# EAGLE design iv-17single (EAGLE 7.2.0)
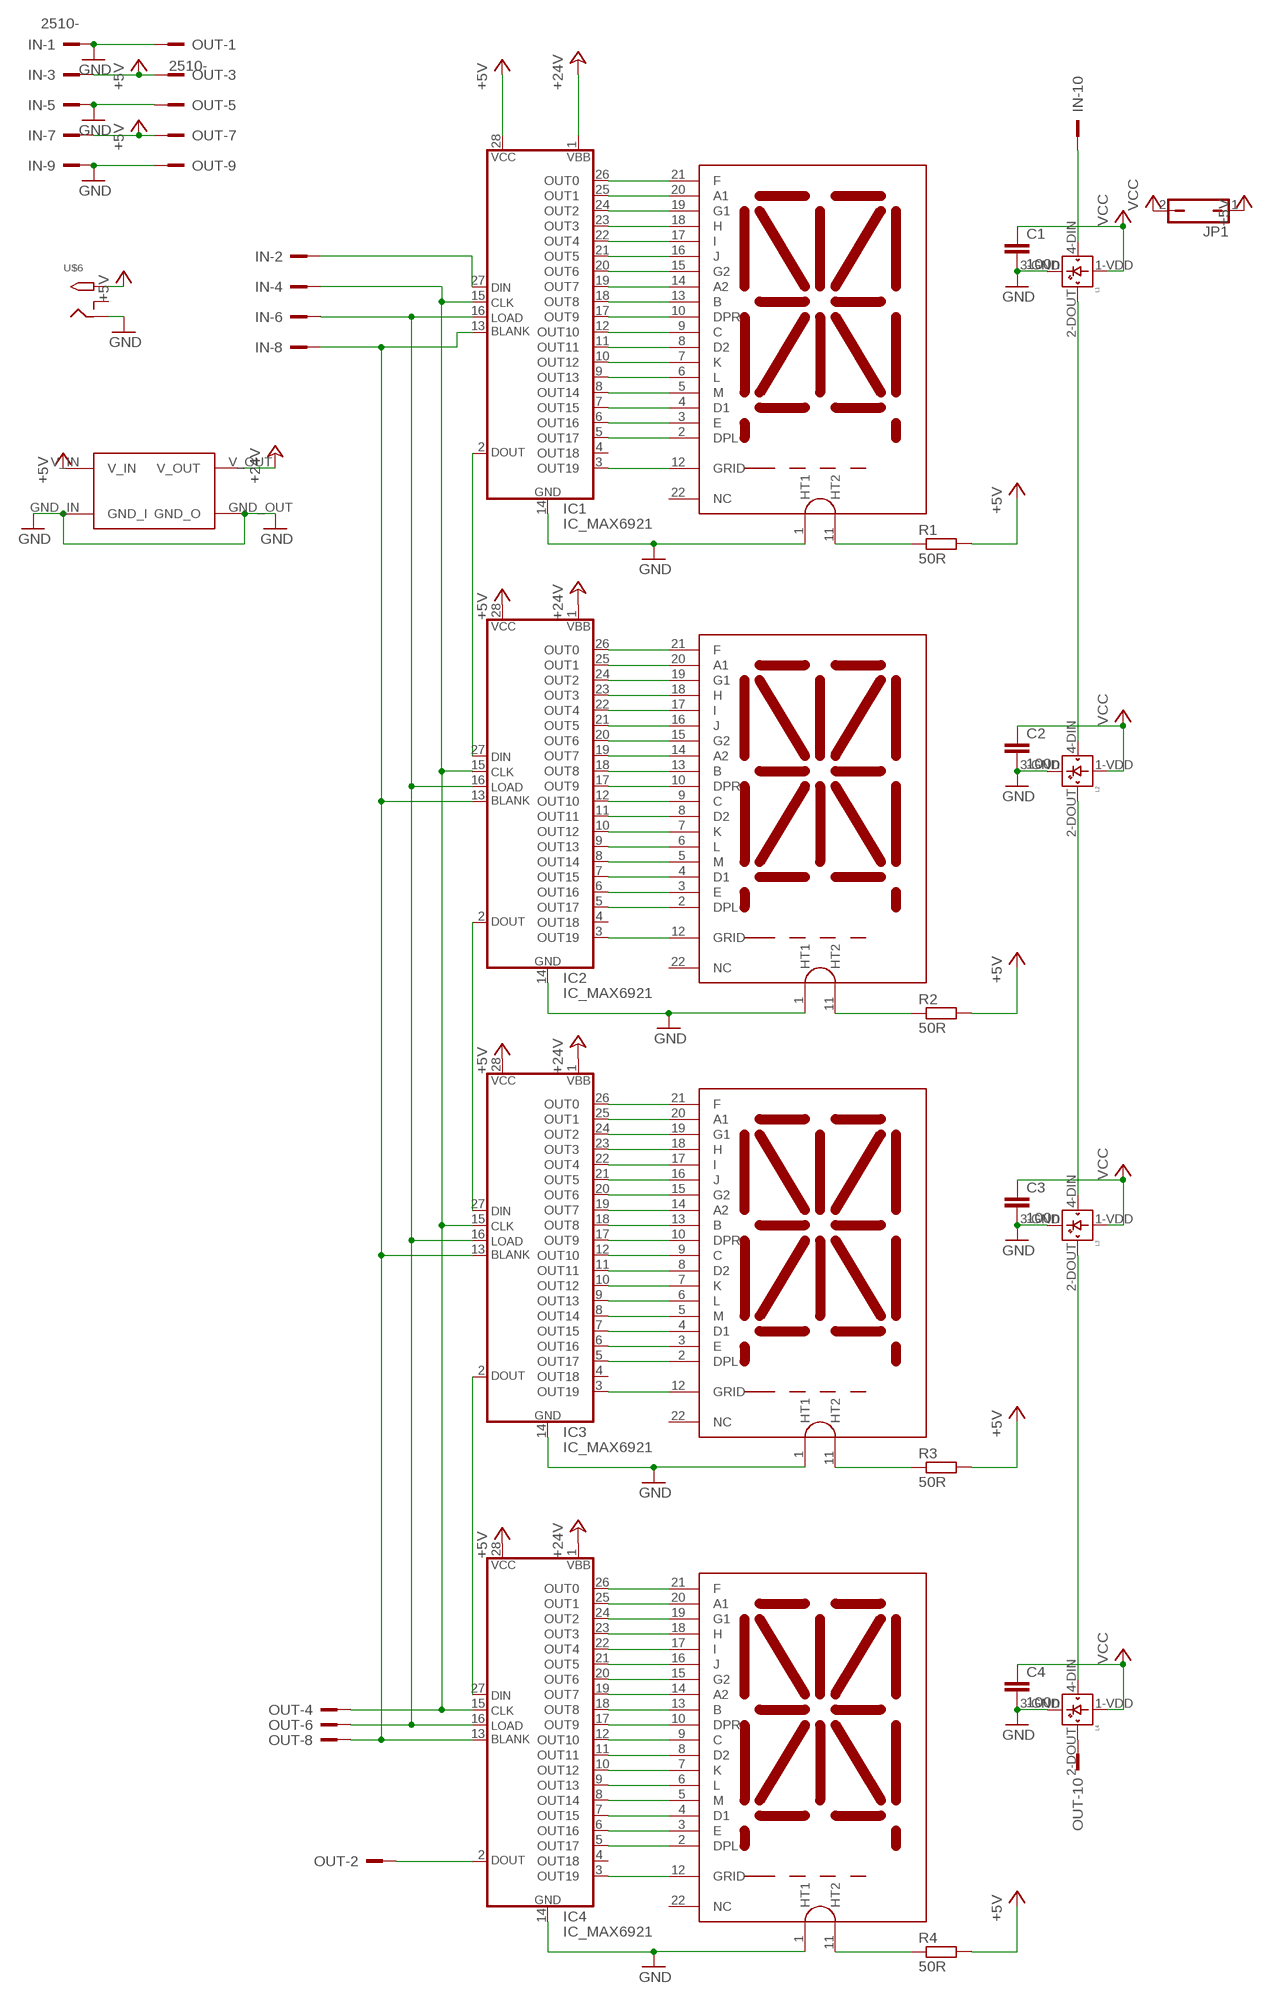
[diagram p0: schematic, sheet 1]

## Parts
1  IV-17_DISPIV-17  [IV-17]
2  IV-17_DISPIV-17  [IV-17]
3  IV-17_DISPIV-17  [IV-17]
4  IV-17_DISPIV-17  [IV-17]
C1  100n  C-EUC0805  [C0805]
C2  100n  C-EUC0805  [C0805]
C3  100n  C-EUC0805  [C0805]
C4  100n  C-EUC0805  [C0805]
IC1  IC_MAX6921  [S28]
IC2  IC_MAX6921  [S28]
IC3  IC_MAX6921  [S28]
IC4  IC_MAX6921  [S28]
IN  2510-  [PAK100/2500-10]
JP1  JP1Q  [JP1]
L1  WS2812B  [WS2812B]
L2  WS2812B  [WS2812B]
L3  WS2812B  [WS2812B]
L4  WS2812B  [WS2812B]
OUT  2510-  [PAK100/2500-10]
R1  50R  R-EU_0207/10  [0207/10]
R2  50R  R-EU_0207/10  [0207/10]
R3  50R  R-EU_0207/10  [0207/10]
R4  50R  R-EU_0207/10  [0207/10]
U$5  STEP_UP_MODULE  [STEP_UP_MODULE]
U$6  2.1MMJACKTHM  [PJ-102A]

## Nets
+5V [power]: IC1.28(VCC) IC2.28(VCC) IC3.28(VCC) IC4.28(VCC) IN.3 IN.7 JP1.1 OUT.3 OUT.7 R1.2 R2.2 R3.2 R4.2 U$5.V_IN U$6.TIP
+24V [lo_power]: IC1.1(VBB) IC2.1(VBB) IC3.1(VBB) IC4.1(VBB) U$5.V_OUT
GND [power]: 1.1(HT1) 2.1(HT1) 3.1(HT1) 4.1(HT1) C1.2 C2.2 C3.2 C4.2 IC1.14(GND) IC2.14(GND) IC3.14(GND) IC4.14(GND) IN.1 IN.5 IN.9 L1.3-GND(GND) L2.3-GND(GND) L3.3-GND(GND) L4.3-GND(GND) OUT.1 OUT.5 OUT.9 U$5.GND_IN(GND_I) U$5.GND_OUT(GND_O) U$6.RING
N$1 [lo_power]: 1.11(HT2) R1.1
N$2: 1.21(F) IC1.26(OUT0)
N$3: 1.20(A1) IC1.25(OUT1)
N$4: 1.19(G1) IC1.24(OUT2)
N$5: 1.18(H) IC1.23(OUT3)
N$6: 1.17(I) IC1.22(OUT4)
N$7: 1.16(J) IC1.21(OUT5)
N$8: 1.15(G2) IC1.20(OUT6)
N$9: 1.14(A2) IC1.19(OUT7)
N$10: 1.13(B) IC1.18(OUT8)
N$11: 1.10(DPR) IC1.17(OUT9)
N$12: 1.9(C) IC1.12(OUT10)
N$13: 1.8(D2) IC1.11(OUT11)
N$14: 1.7(K) IC1.10(OUT12)
N$15: 1.6(L) IC1.9(OUT13)
N$16: 1.5(M) IC1.8(OUT14)
N$17: 1.4(D1) IC1.7(OUT15)
N$18: 1.3(E) IC1.6(OUT16)
N$19: 1.2(DPL) IC1.5(OUT17)
N$20: 1.12(GRID) IC1.3(OUT19)
N$21: IC1.27(DIN) IN.2
N$22: IC4.2(DOUT) OUT.2
N$23: 2.21(F) IC2.26(OUT0)
N$24: L1.2-DOUT(DOUT) L2.4-DIN(DIN)
N$25: IC1.2(DOUT) IC2.27(DIN)
N$26: 2.20(A1) IC2.25(OUT1)
N$27: 2.19(G1) IC2.24(OUT2)
N$28: 2.18(H) IC2.23(OUT3)
N$29: 2.17(I) IC2.22(OUT4)
N$30: 2.16(J) IC2.21(OUT5)
N$31: 2.15(G2) IC2.20(OUT6)
N$32: 2.14(A2) IC2.19(OUT7)
N$33: 2.13(B) IC2.18(OUT8)
N$34: 2.10(DPR) IC2.17(OUT9)
N$35: 2.9(C) IC2.12(OUT10)
N$36: IC1.15(CLK) IC2.15(CLK) IC3.15(CLK) IC4.15(CLK) IN.4 OUT.4
N$37: 2.8(D2) IC2.11(OUT11)
N$38: 2.7(K) IC2.10(OUT12)
N$39: 2.6(L) IC2.9(OUT13)
N$40: 2.5(M) IC2.8(OUT14)
N$41: 2.4(D1) IC2.7(OUT15)
N$42: 2.3(E) IC2.6(OUT16)
N$43: 2.2(DPL) IC2.5(OUT17)
N$44: 2.12(GRID) IC2.3(OUT19)
N$45: IC1.16(LOAD) IC2.16(LOAD) IC3.16(LOAD) IC4.16(LOAD) IN.6 OUT.6
N$46 [lo_power]: 2.11(HT2) R2.1
N$47: 3.21(F) IC3.26(OUT0)
N$48: 3.20(A1) IC3.25(OUT1)
N$49: 3.19(G1) IC3.24(OUT2)
N$50: 3.18(H) IC3.23(OUT3)
N$51: 3.17(I) IC3.22(OUT4)
N$52: 3.16(J) IC3.21(OUT5)
N$53: 3.15(G2) IC3.20(OUT6)
N$54: 3.14(A2) IC3.19(OUT7)
N$55: 3.13(B) IC3.18(OUT8)
N$56: 3.10(DPR) IC3.17(OUT9)
N$57: 3.9(C) IC3.12(OUT10)
N$58: 3.8(D2) IC3.11(OUT11)
N$59: 3.7(K) IC3.10(OUT12)
N$60: 3.6(L) IC3.9(OUT13)
N$61: 3.5(M) IC3.8(OUT14)
N$62: 3.4(D1) IC3.7(OUT15)
N$63: 3.3(E) IC3.6(OUT16)
N$64: 3.2(DPL) IC3.5(OUT17)
N$65: 3.12(GRID) IC3.3(OUT19)
N$66 [power]: IC1.13(BLANK) IC2.13(BLANK) IC3.13(BLANK) IC4.13(BLANK) IN.8 OUT.8
N$67 [lo_power]: 3.11(HT2) R3.1
N$68: 4.21(F) IC4.26(OUT0)
N$69: 4.20(A1) IC4.25(OUT1)
N$70: 4.19(G1) IC4.24(OUT2)
N$71: 4.18(H) IC4.23(OUT3)
N$72: 4.17(I) IC4.22(OUT4)
N$73: 4.16(J) IC4.21(OUT5)
N$74: 4.15(G2) IC4.20(OUT6)
N$75: 4.14(A2) IC4.19(OUT7)
N$76: 4.13(B) IC4.18(OUT8)
N$77: 4.10(DPR) IC4.17(OUT9)
N$78: 4.9(C) IC4.12(OUT10)
N$79: 4.8(D2) IC4.11(OUT11)
N$80: 4.7(K) IC4.10(OUT12)
N$81: 4.6(L) IC4.9(OUT13)
N$82: 4.5(M) IC4.8(OUT14)
N$83: 4.4(D1) IC4.7(OUT15)
N$84: 4.3(E) IC4.6(OUT16)
N$85: 4.2(DPL) IC4.5(OUT17)
N$86: 4.12(GRID) IC4.3(OUT19)
N$87: L2.2-DOUT(DOUT) L3.4-DIN(DIN)
N$88 [lo_power]: 4.11(HT2) R4.1
N$89: L3.2-DOUT(DOUT) L4.4-DIN(DIN)
N$90: IN.10 L1.4-DIN(DIN)
N$91: L4.2-DOUT(DOUT) OUT.10
N$131: IC2.2(DOUT) IC3.27(DIN)
N$132: IC3.2(DOUT) IC4.27(DIN)
VCC [lo_power]: C1.1 C2.1 C3.1 C4.1 JP1.2 L1.1-VDD(VDD) L2.1-VDD(VDD) L3.1-VDD(VDD) L4.1-VDD(VDD)
Unconnected: 1.22(NC) 2.22(NC) 3.22(NC) 4.22(NC) IC1.4(OUT18) IC2.4(OUT18) IC3.4(OUT18) IC4.4(OUT18) U$6.RING_SW

## Library data of the parts
1-4 = vfd:IV-17_DISP
C1-C4 = resistor:C-EU: CAPACITOR, European symbol
IC1-IC4 = rob:IC_MAX6921: 20-outputs, 76V, serial VFD driver Dangerousprototypes.com
IN OUT = con-3m:2510-: 3M (TM) Pak 100 4-Wall Header Source: 3M; MF: 3M; MPN: 2510-6002UB; OC_FARNELL: 9838244; OC_NEWARK: 46F4725
JP1 = jumper:JP1Q: JUMPER
L1-L4 = adafruit:WS2812B
R1-R4 = resistor:R-EU_: RESISTOR, European symbol
U$5 = vfd:STEP_UP_MODULE
U$6 = adafruit:2.1MMJACK: 2.1mm x 5.5mm THM DC jack with internal switch. Digikey part #PJ-102A, 4UCON part #05537 2.1mm x 5.5mm SMT DC jack with internal switch. Digikey part #PJ-002A-SMT, 4UCON part #03267 By microbuilder.eu & adafruit.com

## Net classes
1 lo_power: width 0.5 mm
2 power: width 1 mm

## Board
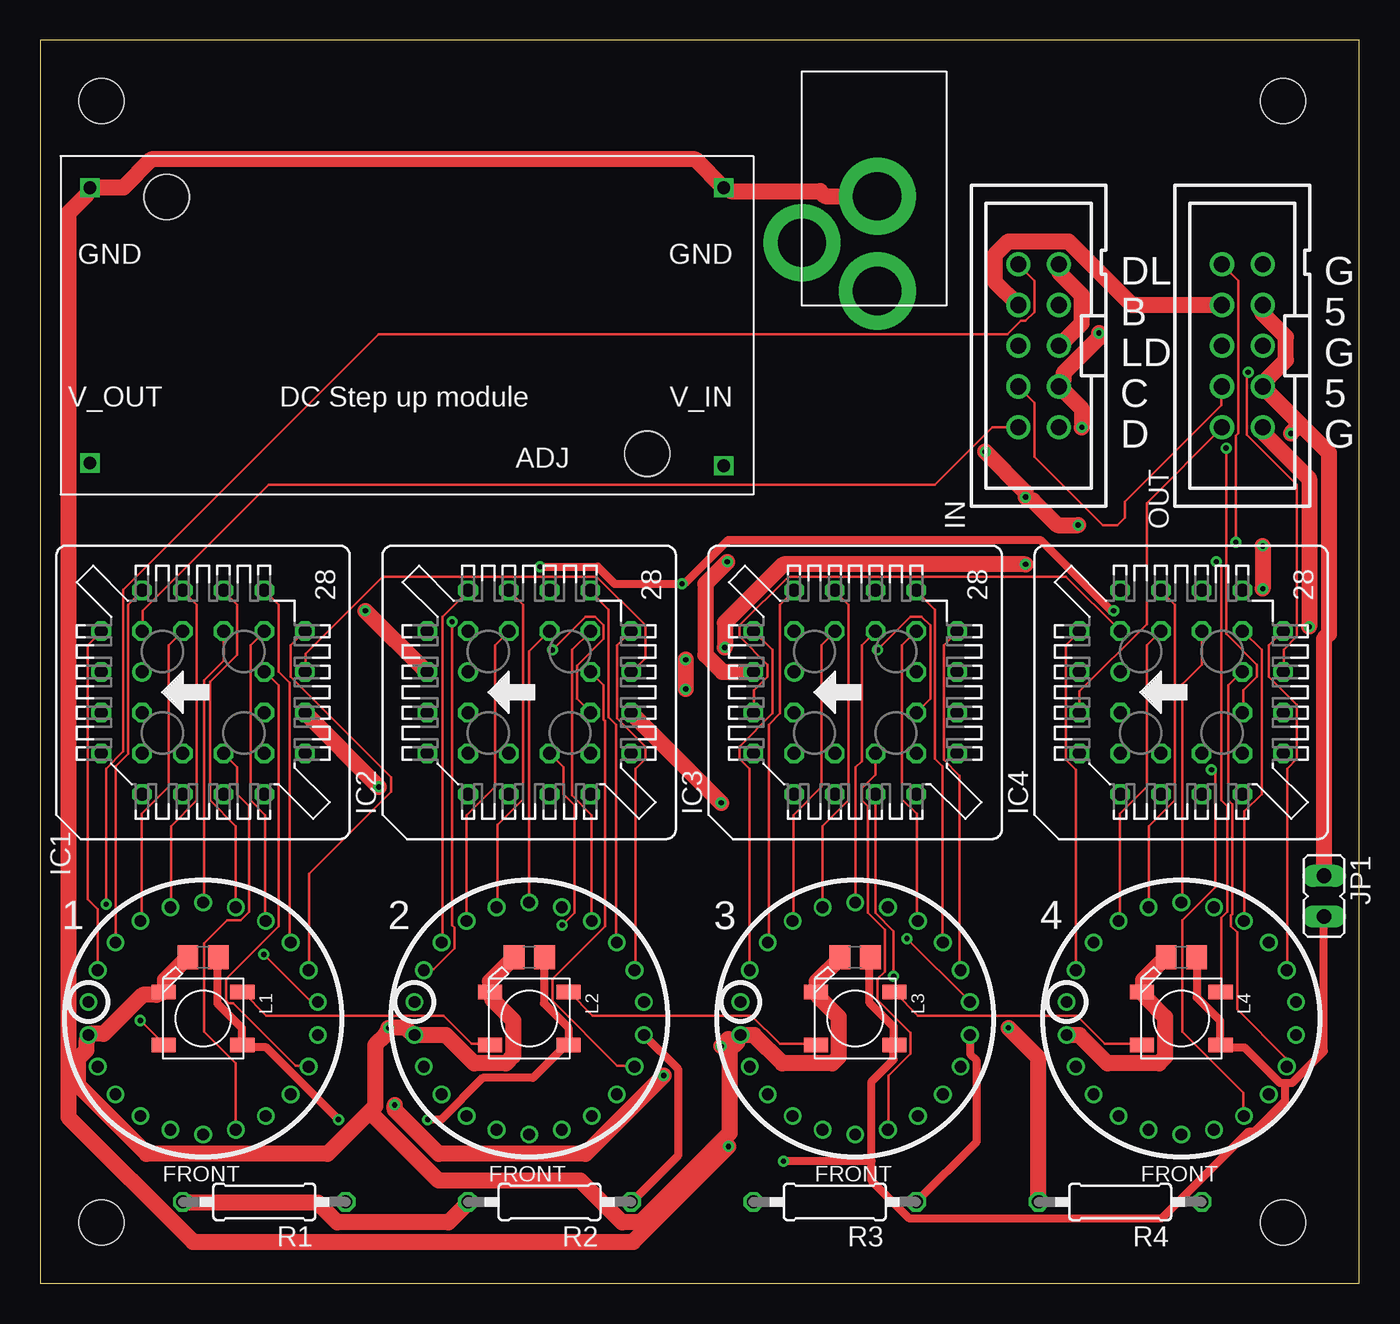
[diagram p1: board, top side]
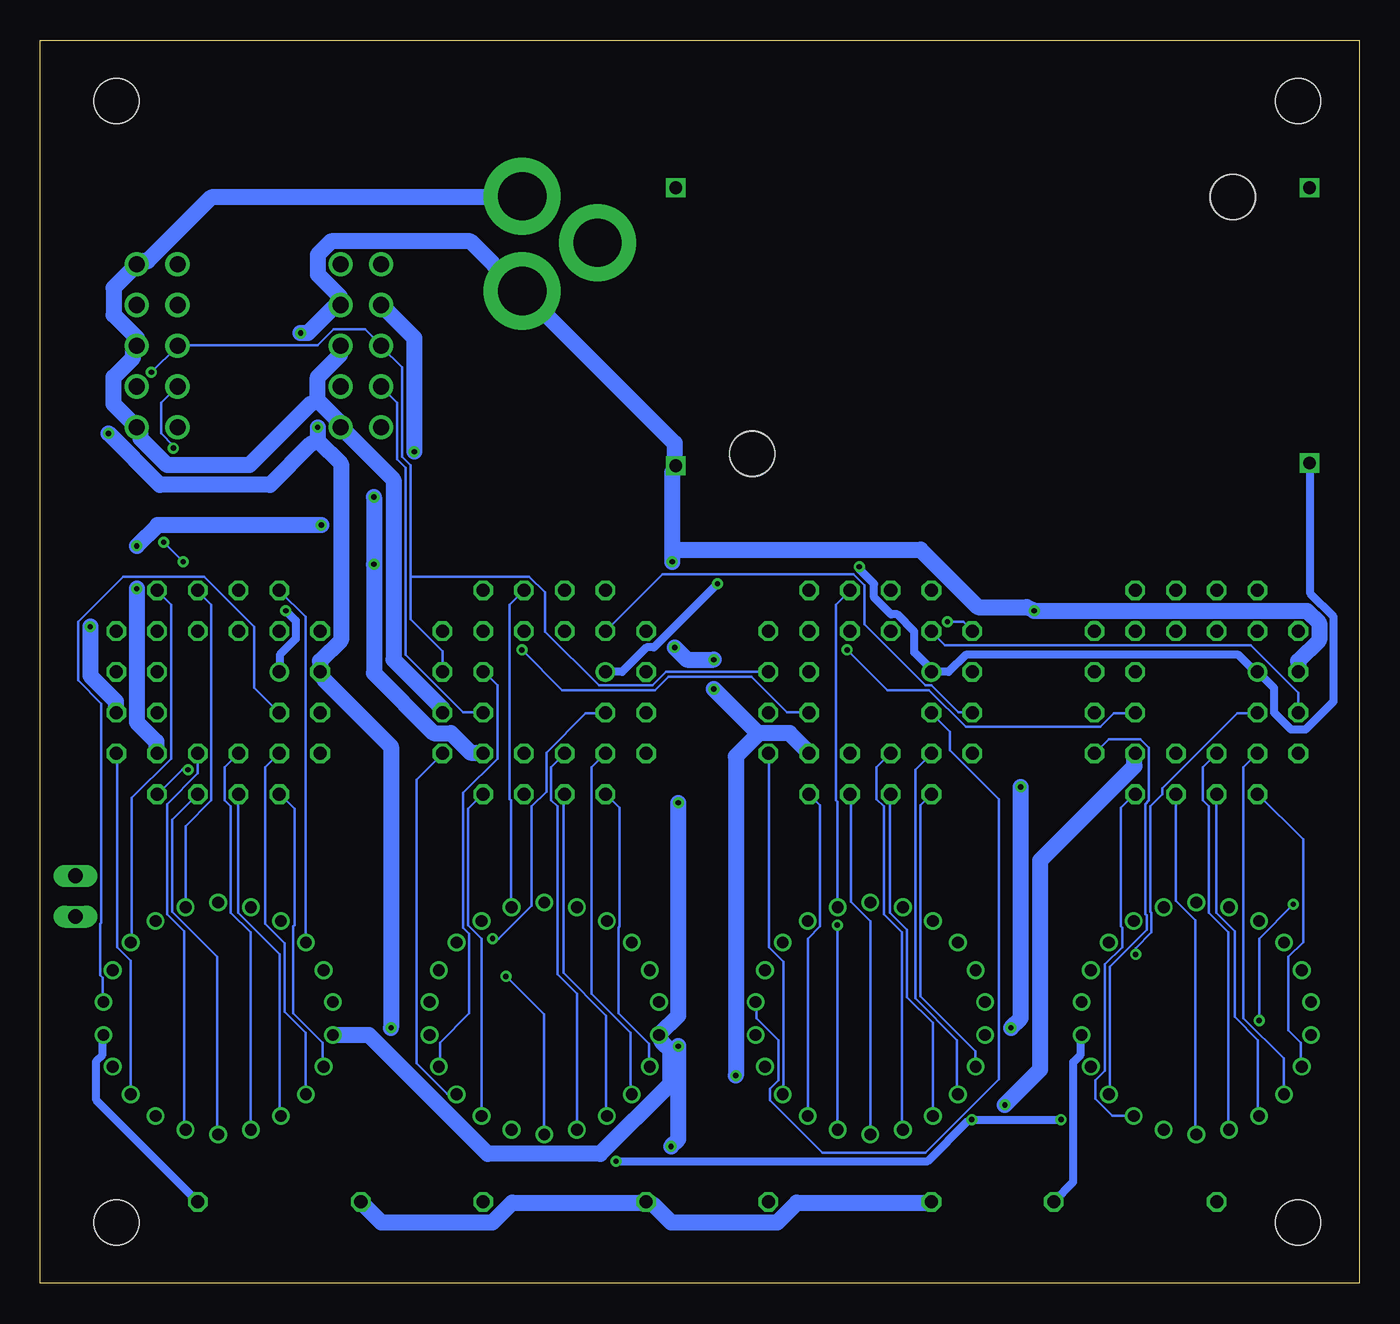
[diagram p2: board, bottom side, seen from below]

Size 82.22 x 77.46 mm. Coordinates in mm from the lower left corner, seen from the top.
Outline: 0,0 82.22,0 82.22,77.46 0,77.46 0,0
Copper layers (1*16): Top 0.0356mm / dielectric 1.5011mm / Bottom 0.0356mm
Design rules "oshpark-2layer": minimum track width 6mil, minimum drill 13mil, track to track 6mil, track to pad 6mil, pad to pad 6mil, via to via 6mil, smd to smd 6mil, copper to edge 15mil, drill to drill 6mil, minimum pad ring 7mil, minimum via ring 7mil, stop-mask expansion 4mil, vias tented up to drill 0mil, thermal gap 10mil
Holes 2.8 mm at 3.81,3.81 3.81,73.66 7.9,67.7 77.47,73.66 77.47,3.81 37.85,51.7

### Footprints (pad centres in the part's own frame; a part is rotated, then mirrored left to right if it is on the bottom)
IV-17 = drill 0.735: 1 -7.15,-1.028; 2 -6.571,-3.001; 3 -5.459,-4.73; 4 -3.905,-6.077; 5 -2.035,-6.931; 6 0,-7.223; 7 2.035,-6.931; 8 3.905,-6.077; 9 5.459,-4.73; 10 6.571,-3.001; 11 7.15,-1.028; 12 7.15,1.028; 13 6.571,3.001; 14 5.459,4.73; 15 3.905,6.077; 16 2.035,6.931; 17 0,7.223; 18 -2.035,6.931; 19 -3.905,6.077; 20 -5.459,4.73; 21 -6.571,3.001; 22 -7.15,1.028
C0805 = smd 1.3 x 1.5: 1 -0.95,0; 2 0.95,0
S28 = drill 0.813: 1 1.27,3.81 | drill 0.813 octagon: 2 -1.27,6.35; 3 -1.27,3.81; 4 -3.81,6.35; 5 -6.35,3.81; 6 -3.81,3.81; 7 -6.35,1.27; 8 -3.81,1.27; 9 -6.35,-1.27; 10 -3.81,-1.27; 11 -6.35,-3.81; 12 -3.81,-6.35; 13 -3.81,-3.81; 14 -1.27,-6.35; 15 -1.27,-3.81; 16 1.27,-6.35; 17 1.27,-3.81; 18 3.81,-6.35; 19 6.35,-3.81; 20 3.81,-3.81; 21 6.35,-1.27; 22 3.81,-1.27; 23 6.35,1.27; 24 3.81,1.27; 25 6.35,3.81; 26 3.81,6.35; 27 3.81,3.81; 28 1.27,6.35
PAK100/2500-10 = drill 1 pad 1.422: 1 -5.08,-1.27; 2 -5.08,1.27; 3 -2.54,-1.27; 4 -2.54,1.27; 5 0,-1.27; 6 0,1.27; 7 2.54,-1.27; 8 2.54,1.27; 9 5.08,-1.27; 10 5.08,1.27
JP1 = drill 0.914 long: 1 0,-1.27; 2 0,1.27
WS2812B = smd 1.5 x 0.9: 1-VDD 2.45,-1.65; 2-DOUT 2.45,1.65; 3-GND -2.45,1.65; 4-DIN -2.45,-1.65
0207/10 = drill 0.813 octagon: 1 -5.08,0; 2 5.08,0
STEP_UP_MODULE = drill 0.8 square: GND_IN -19.749,-8.573; GND_OUT 19.749,-8.573; V_IN -19.749,8.753; V_OUT 19.749,8.573 | hole 2.8: -14.986,8.001; 14.986,-8.001
PJ-102A = drill 3 pad 4.8: RING 0.1,-3.39; RING_SW -4.6,-6.29; TIP 0.1,-9.29

### Placement (x,y rotation side)
1  10.16,16.51 0 top
2  30.48,16.51 0 top
3  50.8,16.51 0 top
4  71.12,16.51 0 top
C1  10.16,20.32 180 top
C2  30.48,20.32 180 top
C3  50.8,20.32 180 top
C4  71.12,20.32 180 top
IC1  10.16,36.83 90 top
IC2  30.48,36.83 90 top
IC3  50.8,36.83 90 top
IC4  71.12,36.83 90 top
IN  62.23,58.42 90 top
JP1  80.01,24.13 180 top
L1  10.16,16.51 0 top
L2  30.48,16.51 0 top
L3  50.8,16.51 0 top
L4  71.12,16.51 0 top
OUT  74.93,58.42 90 top
R1  13.97,5.08 180 top
R2  31.75,5.08 180 top
R3  49.53,5.08 180 top
R4  67.31,5.08 180 top
U$5  22.86,59.69 180 top
U$6  52.07,71.12 0 top

### Tracks (layer width: path | path; a pad name or v marks a point on that pad's centre or on a via)
+5V  (via drill 0.33)
  Top 1: R1.2 8.91,5.03 17.3,5.03 18.52,3.81 25.45,3.81 26.67,5.03 R2.2 | JP1.1 80.01,40.16 80.31,40.46 80.31,51.74 78.52,53.53 | 78.52,53.53 76.2,55.85 OUT.3 76.43,56.31 77.65,57.53 77.65,58.98 76.2,60.43 OUT.7 | v20.27,41.91 24.08,38.1 IC2.28 | v64.92,53.34 64.92,54.48 63.55,55.85 IN.3 63.78,56.31 63.78,56.69 65.99,58.9 v65.99,59.21 | IC3.28 42.52,38.1 41.45,39.17 41.45,43.59 v42.82,44.96 | v77.95,52.96 78.52,53.53 | v60.35,15.93 62.18,14.1 62.18,5.11 R4.2
  Bottom 1: R4.2 60.96,3.81 54.03,3.81 52.81,5.03 44.5,5.03 R3.2 43.97,4.88 42.9,3.81 36.27,3.81 35.05,5.03 26.67,5.03 R2.2 | IC1.28 3.81,38.79 2.52,40.08 2.52,41.15 3.28,41.91 v20.27,41.91 20.73,42.14 23.77,42.14 27.36,45.72 42.82,45.72 | 64.92,52.5 63.48,51.05 63.48,40.08 64.77,38.79 IC4.28 64.54,37.64 60.35,33.45 v60.35,15.93 | v64.92,53.34 64.92,52.5 | 42.82,45.72 42.82,50.52 U$5.V_IN 42.67,50.98 42.67,52.35 52.12,61.8 U$6.TIP 52.58,62.1 55.4,64.92 64.08,64.92 64.92,64.08 64.92,62.87 63.55,61.49 63.55,60.96 IN.7 64.01,60.73 65.53,59.21 v65.99,59.21 | 42.82,45.72 v42.82,44.96 | v77.95,52.96 74.75,49.76 67.89,49.76 65.38,52.27 64.92,52.5
+24V  (via drill 0.33)
  Top 0.5: v31.17,44.65 34.75,44.65 35.81,43.59 v40.01,43.59 40.23,43.66 42.9,46.33 62.33,46.33 66.75,41.91 v66.9,41.91
  Bottom 0.5: U$5.V_OUT 3.05,51.05 3.05,42.98 1.6,41.53 1.6,36.27 3.35,34.52 4.27,34.52 5.33,35.59 5.33,37.11 6.33,38.1 IC1.1 6.55,38.18 7.54,39.17 24.54,39.17 25.6,38.1 IC2.1 26.75,38.33 27.74,39.32 27.74,40.62 28.8,41.68 29.18,41.68 30.25,42.75 30.25,43.59 31.17,44.5 v31.17,44.65 | IC3.1 45.95,38.1 44.42,39.62 43.97,39.62 v40.01,43.59 | v66.9,41.91 66.29,41.3 66.29,40.16 67.28,39.17 67.28,38.1 IC4.1
GND  (via drill 0.33)
  Top 1: C1.2 9.14,20.27 7.77,18.9 7.77,18.21 L1.3-GND 7.24,17.98 6.4,17.98 3.96,15.54 3.05,15.54 1.1 2.9,15.01 2.9,14.55 2.36,14.02 2.36,12.34 6.63,8.08 17.91,8.08 20.54,10.71 | C2.2 29.49,20.27 28.04,18.82 28.04,18.21 L2.3-GND 28.19,17.68 29.49,16.38 29.49,14.17 29.03,13.72 27.05,13.72 25.3,15.47 23.39,15.47 2.1 22.94,15.77 22.78,15.93 v21.72,15.93 21.49,15.47 20.88,14.86 20.88,11.05 20.54,10.71 | v21.11,30.94 16.54,35.51 IC1.14 | C4.2 70.1,20.27 68.73,18.9 68.73,18.21 L4.3-GND 68.96,17.75 70.1,16.61 70.1,14.1 69.72,13.72 66.52,13.72 64.77,15.47 64.01,15.47 4.1 | C3.2 49.84,20.27 48.39,18.82 48.39,18.21 L3.3-GND 48.62,17.75 49.76,16.61 49.76,14.1 49.38,13.72 46.25,13.72 44.5,15.47 43.66,15.47 3.1 43.43,15.01 43.28,14.86 | v42.44,29.95 IC2.14 | 20.54,10.71 24.84,6.4 33.68,6.4 36.27,3.81 37.41,3.81 42.98,9.37 42.98,14.55 43.28,14.86 | v79.1,40.92 79.1,50.14 76.2,53.03 OUT.1 | IN.9 63.55,63.48 63.55,62.94 64.92,61.57 64.92,59.82 63.55,58.45 IN.5 | U$6.RING 52.12,67.74 48.92,67.74 48.62,68.05 43.05,68.05 U$5.GND_IN 42.6,68.28 40.84,70.03 6.93,70.03 5.18,68.28 3.12,68.28 U$5.GND_OUT 2.9,67.82 1.75,66.67 1.75,10.36 9.53,2.59 36.96,2.59 v42.9,8.53 | v42.44,14.78 42.9,15.24 43.28,14.86
  Bottom 1: v21.11,30.94 21.11,16.54 v21.72,15.93 | v42.44,29.95 42.44,16.69 43.59,15.54 3.1 43.43,15.01 42.98,14.55 42.98,12.42 47.32,8.08 54.33,8.08 61.72,15.47 63.93,15.47 4.1 | v79.1,40.92 79.1,37.87 77.5,36.27 77.5,35.59 IC4.14 | IC3.14 57.15,35.81 60.2,38.86 60.2,50.06 63.48,53.34 IN.1 63.7,53.8 64.92,55.02 | 64.92,55.02 64.92,56.46 63.55,57.84 63.55,58.37 IN.5 | 64.92,55.02 65.38,54.79 69.19,50.98 74.3,50.98 75.97,52.65 75.97,52.88 OUT.1 77.65,54.79 77.65,56.46 76.43,57.68 76.43,57.99 OUT.5 76.2,58.9 77.65,60.35 77.65,62.03 76.2,63.48 OUT.9 75.74,63.7 75.51,63.7 71.55,67.67 52.2,67.67 U$6.RING | v42.44,14.78 42.44,8.99 v42.9,8.53
N$1
  Bottom 0.5: 1.11 17.37,15.47 17.37,14.25 17.83,13.79 17.83,6.33 19.05,5.11 R1.1
N$2
  Top 0.152: 1.21 3.58,19.58 3.58,23.32 2.97,23.93 2.97,39.78 3.81,40.62 IC1.26
N$3
  Top 0.152: 1.20 4.72,21.26 4.72,32.23 5.49,32.99 5.49,42.29 6.33,43.13 IC1.25
N$4
  Top 0.152: 1.19 6.33,22.63 6.33,29.26 8,30.94 8,39.78 8.84,40.62 IC1.24
N$5
  Top 0.152: 1.18 8.15,23.47 8.15,28.5 9.75,30.1 9.75,42.29 8.91,43.13 IC1.23
N$6
  Top 0.152: IC1.22 11.43,38.79 10.21,37.57 10.21,23.77 1.17
N$7
  Top 0.152: 1.16 12.19,23.47 12.19,28.5 10.59,30.1 10.59,37.49 12.27,39.17 12.27,42.29 11.43,43.13 IC1.21
N$8
  Top 0.152: IC1.20 13.11,39.78 13.11,30.1 14.02,29.18 14.02,22.63 1.15
N$9
  Top 0.152: IC1.19 14.86,42.29 14.86,38.1 15.54,37.41 15.54,21.26 1.14
N$10
  Top 0.152: 1.13 16.76,19.58 16.76,25.53 21.87,30.63 21.87,31.55 15.62,37.8 15.62,39.78 16.46,40.62 IC1.18
N$11
  Top 0.152: 1.10 16.69,13.56 15.93,13.56 12.04,17.45 11.73,17.45 11.58,17.6 11.58,18.97 14.86,22.25 14.86,37.26 14.02,38.1 IC1.17
N$12
  Bottom 0.152: IC1.12 15.62,33.91 13.64,33.91 13.11,33.38 13.11,30.1 13.34,29.87 13.34,23.01 13.26,22.94 13.26,22.02 15.54,19.74 15.54,11.81 1.9
N$13
  Bottom 0.152: 1.8 14.1,10.44 15.39,10.44 16.46,11.51 16.46,12.65 15.85,13.26 15.85,19.89 14.78,20.95 14.78,22.17 14.86,22.25 14.86,29.64 14.02,30.48 IC1.11
N$14
  Top 0.152: 1.7 12.19,9.6 12.19,13.72 10.21,15.7 10.21,21.18 11.66,22.63 12.5,22.63 13.03,23.16 13.03,29.72 12.27,30.48 12.27,32.16 11.43,32.99 IC1.10
N$15
  Bottom 0.152: IC1.9 11.43,23.85 10.21,22.63 10.21,9.3 1.6
N$16
  Bottom 0.152: IC1.8 9.75,32.16 9.75,30.1 9.37,29.72 9.37,23.09 8.15,21.87 8.15,9.6 1.5
N$17
  Bottom 0.152: 1.4 6.33,10.44 6.33,15.16 7.77,16.61 7.77,21.95 8.91,23.09 8.91,30.48 IC1.7
N$18
  Bottom 0.152: 1.3 4.72,11.81 4.72,14.02 7.24,16.54 7.24,32.16 6.4,32.99 IC1.6
N$19
  Bottom 0.152: 1.2 3.66,13.56 3.66,15.01 4.42,15.77 4.42,20.34 3.5,21.26 3.5,27.66 6.33,30.48 IC1.5
N$20  (via drill 0.33)
  Top 0.152: v13.95,20.5 16.84,17.6 17.3,17.6 1.12
  Bottom 0.152: v13.95,20.5 13.95,20.88 12.95,21.87 12.95,23.09 13.03,23.16 13.03,29.72 12.27,30.48 12.27,30.86 7.62,35.51 6.4,35.51 IC1.3
N$21
  Top 0.152: IN.2 59.36,53.34 55.78,49.76 14.25,49.76 6.4,41.91 6.4,40.69 IC1.27
N$22
  Top 0.152: IC4.2 64.77,36.88 68.96,41.07 68.96,48.62 73.69,53.34 OUT.2
N$23  (via drill 0.33)
  Top 0.152: v25.68,41.22 25.68,22.33 25.83,22.17 25.83,20.88 24.54,19.58 23.93,19.58 2.21
  Bottom 0.152: v25.68,41.22 24.69,41.22 24.16,40.69 IC2.26
N$24
  Top 0.152: L2.4-DIN 27.96,14.94 26.9,14.94 25.15,16.69 14.1,16.69 12.65,18.14 L1.2-DOUT
N$25
  Bottom 0.152: IC1.2 3.81,36.8 6.78,39.78 25.83,39.78 26.67,40.62 IC2.27
N$26
  Top 0.152: 2.20 25.07,21.26 25.07,41.53 26.67,43.13 IC2.25
N$27
  Top 0.152: IC2.24 28.35,39.78 28.35,30.94 26.59,29.18 26.59,22.63 2.19
N$28
  Top 0.152: IC2.23 30.1,42.29 30.1,30.18 28.5,28.57 28.5,23.47 2.18
N$29
  Top 0.152: 2.17 30.48,39.4 31.7,40.62 IC2.22
N$30
  Bottom 0.152: 2.16 32.54,23.47 32.54,30.02 32.61,30.1 32.61,42.29 31.77,43.13 IC2.21
N$31
  Top 0.152: 2.15 34.37,22.63 34.37,29.18 33.15,30.4 33.15,39.47 34.29,40.62 IC2.20
N$32
  Top 0.152: 2.14 35.89,21.26 35.89,34.82 35.43,35.28 35.43,41.99 34.29,43.13 IC2.19
N$33
  Top 0.152: IC2.18 35.97,39.78 35.97,35.2 37.72,33.45 37.72,32.69 37.11,32.08 37.11,19.58 2.13
N$34
  Top 0.152: IC2.17 35.13,37.26 35.13,35.13 35.2,35.05 35.2,22.25 31.93,18.97 31.93,17.6 35.97,13.56 37.03,13.56 2.10
N$35
  Bottom 0.152: 2.9 35.89,11.81 35.89,20.04 36.8,20.95 36.8,32.99 IC2.12
N$36  (via drill 0.33)
  Top 0.152: v31.93,39.47 33.98,41.53 34.59,41.53 35.13,41 35.13,40.16 33.45,38.48 33.45,36.42 34.29,35.59 IC2.15 | v73.91,52.05 73.91,40.46 75.82,38.56 75.82,37.8 74.98,36.96 74.98,35.59 IC4.15 | OUT.4 73.61,55.85 73.61,54.71 67.59,48.69 67.59,47.7 67.13,47.24 66.22,47.24 61.95,51.51 61.95,54.86 60.96,55.85 IN.4 | v52.2,39.47 54.25,41.53 54.94,41.53 55.47,41 55.47,36.42 IC3.15
  Bottom 0.152: v31.93,39.47 29.41,36.96 26.82,36.96 24.54,34.67 16.15,34.67 15.32,35.51 14.02,35.51 IC1.15 | v73.91,52.05 73.91,52.2 74.68,52.96 74.68,54.86 OUT.4 | IC3.15 54.63,35.59 55.85,35.59 59.44,39.17 59.44,50.83 59.97,51.36 59.97,54.86 60.96,55.85 IN.4 | v52.2,39.47 49.68,36.96 43.89,36.96 43.05,37.8 37.87,37.8 35.66,35.59 34.29,35.59 IC2.15
N$37
  Bottom 0.152: IC2.11 33.6,29.79 33.6,22.25 34.37,21.49 34.37,10.44 2.8
N$38  (via drill 0.33)
  Top 0.152: v32.54,22.33 33.3,23.09 33.3,29.79 32.61,30.48 32.61,32.16 IC2.10
  Bottom 0.152: v32.54,22.33 32.54,9.6 2.7
N$39
  Bottom 0.152: 2.6 30.48,22.55 31.7,23.77 31.7,30.48 IC2.9
N$40
  Bottom 0.152: 2.5 28.5,9.6 28.5,21.87 29.64,23.01 29.64,29.72 30.1,30.18 30.1,32.16 29.26,32.99 IC2.8
N$41
  Bottom 0.152: 2.4 26.59,10.44 26.59,16.23 28.19,17.83 28.19,22.02 29.26,23.09 29.26,30.48 IC2.7
N$42
  Bottom 0.152: 2.3 25.07,11.81 25.07,15.16 27.66,17.75 27.66,32 26.67,32.99 IC2.6
N$43
  Bottom 0.152: IC2.5 27.36,29.79 27.36,17.91 23.93,14.48 23.93,13.56 2.2
N$44
  Bottom 0.152: 2.12 37.57,17.53 37.57,16.54 36.2,15.16 36.2,12.65 36.73,12.12 36.73,11.43 33.45,8.15 27.05,8.15 22.48,12.72 22.48,30.18 25.53,33.22 25.53,34.37 26.67,35.51 IC2.3
N$45  (via drill 0.33)
  Top 0.152: v75.29,56.77 75.21,56.69 75.21,52.88 78.33,49.76 78.33,40.31 77.5,39.47 77.5,38.1 IC4.16 | IC1.16 16.54,38.1 16.54,39.24 21.34,44.04 34.67,44.04 37.72,41 37.72,38.94 36.88,38.1 IC2.16
  Bottom 0.152: v75.29,56.77 73.69,58.37 OUT.6 73.61,58.45 64.92,58.45 63.93,59.44 61.95,59.44 60.96,58.45 IN.6 60.96,58.37 59.66,57.07 59.66,51.51 59.13,50.98 59.13,44.04 | IC3.16 57.15,39.4 59.13,41.38 59.13,44.04 | IC2.16 43.2,38.1 44.04,37.26 47.4,37.26 50.75,40.62 50.75,43.05 51.74,44.04 59.13,44.04
N$46
  Top 0.5: 2.11 37.64,15.47 39.78,13.34 39.78,8 36.88,5.11 R2.1
N$47
  Top 0.152: 3.21 44.2,19.58 44.2,32.08 43.59,32.69 43.59,33.45 45.64,35.51 45.64,39.47 44.5,40.62 IC3.26
N$48
  Top 0.152: IC3.25 46.1,42.29 46.1,35.51 45.41,34.82 45.41,21.26 3.20
N$49
  Top 0.152: 3.19 46.94,22.63 46.94,29.18 48.69,30.94 48.69,39.78 49.53,40.62 IC3.24
N$50
  Top 0.152: 3.18 48.77,23.47 48.77,28.5 50.37,30.1 50.37,42.29 49.53,43.13 IC3.23
N$51
  Top 0.152: IC3.22 51.21,39.78 51.21,32.54 50.83,32.16 50.83,23.77 3.17
N$52
  Bottom 0.152: IC3.21 52.96,42.29 52.96,30.18 52.88,30.1 52.88,23.47 3.16
N$53
  Top 0.152: 3.15 54.63,22.63 54.63,29.26 53.72,30.18 53.72,39.78 54.56,40.62 IC3.20
N$54
  Top 0.152: 3.14 56.24,21.26 56.24,32.23 55.78,32.69 55.78,41.99 54.63,43.13 IC3.19
N$55
  Top 0.152: 3.13 57.3,19.58 57.3,31.62 56.31,32.61 56.31,39.78 57.15,40.62 IC3.18
N$56
  Bottom 0.152: 3.10 57.3,13.56 57.3,15.01 55.47,16.84 55.47,21.79 55.85,22.17 55.85,30.56 53.72,32.69 53.72,37.26 54.56,38.1 IC3.17
N$57
  Bottom 0.152: 3.9 56.31,11.81 56.84,11.81 58.75,13.72 58.75,31.39 57.15,32.99 IC3.12
N$58
  Bottom 0.152: 3.8 54.71,21.49 55.55,22.33 55.55,29.57 54.63,30.48 IC3.11
N$59
  Top 0.152: 3.7 52.88,9.6 52.88,12.95 54.25,14.33 54.25,15.62 52.2,17.68 52.2,18.97 52.65,19.43 52.65,22.02 51.59,23.09 51.59,29.72 51.21,30.1 51.21,30.86 52.05,31.7 52.05,32.99 IC3.10
N$60  (via drill 0.33)
  Top 0.152: v53.19,19.13 53.19,21.95 52.05,23.09 52.05,30.48 IC3.9
  Bottom 0.152: v53.19,19.13 50.83,16.76 50.83,9.3 3.6
N$61
  Bottom 0.152: 3.5 48.77,9.6 48.77,18.06 49.99,19.28 49.99,29.72 50.37,30.1 50.37,32.16 49.53,32.99 IC3.8
N$62
  Bottom 0.152: IC3.7 49.61,30.4 49.61,19.36 46.94,16.69 46.94,10.44 3.4
N$63
  Bottom 0.152: IC3.6 47.85,32.16 47.85,18.06 45.41,15.62 45.41,11.81 3.3
N$64
  Bottom 0.152: 3.2 44.27,13.56 44.27,14.94 46.18,16.84 46.18,22.17 46.1,22.25 46.1,29.64 46.94,30.48 IC3.5
N$65  (via drill 0.33)
  Top 0.152: v54.03,21.49 57.91,17.6 3.12
  Bottom 0.152: v54.03,21.49 53.65,21.49 51.59,23.55 51.59,29.72 50.67,30.63 50.67,33.07 48.23,35.51 47.02,35.51 IC3.3
N$66  (via drill 0.33)
  Top 1: v22.1,11.12 22.1,10.82 24.84,8.08 33.98,8.08 v38.86,12.95 | v58.9,51.82 61.42,49.3 v61.42,49 61.87,48.77 63.4,47.24 v64.69,47.24 | v76.2,45.95 v76.2,43.28 | OUT.8 68.05,60.96 64.08,64.92 60.35,64.92 59.51,64.08 59.51,62.41 IN.8 | v40.23,38.86 v40.23,37.03 | v42.67,39.62 42.67,41.15 46.33,44.81 v61.42,44.81
  Bottom 1: v22.1,11.12 19.89,13.34 19.89,26.36 14.02,32.23 14.02,32.99 IC1.13 | v38.86,12.95 38.86,32.84 37.45,34.25 | 37.45,34.25 37.41,34.29 35.51,34.29 34.29,33.07 IC2.13 | v61.42,49 v61.42,44.81 61.42,38.02 57.68,34.29 56.62,34.29 55.4,33.07 54.63,33.07 IC3.13 | v58.9,51.82 58.9,58.9 IN.8 | v76.2,43.28 76.2,34.98 74.98,33.76 74.98,33.07 IC4.13 | v76.2,45.95 74.91,47.24 v64.69,47.24 | v40.23,37.03 37.45,34.25 | v40.23,38.86 41.91,38.86 v42.67,39.62
N$67
  Top 0.5: R3.1 58.37,8.84 58.37,13.87 57.99,14.25 57.99,15.47 3.11
N$68
  Top 0.152: 4.21 64.54,19.58 64.54,32 63.93,32.61 63.93,39.78 64.77,40.62 IC4.26
N$69
  Bottom 0.152: 4.20 65.68,21.26 65.68,41.53 67.28,43.13 IC4.25
N$70
  Top 0.152: 4.19 67.28,22.63 67.28,29.26 68.96,30.94 68.96,39.78 69.8,40.62 IC4.24
N$71
  Top 0.152: 4.18 69.11,23.47 69.11,28.5 70.71,30.1 70.71,42.29 69.88,43.13 IC4.23
N$72
  Top 0.152: IC4.22 72.39,38.56 71.17,37.34 71.17,23.77 4.17
N$73
  Bottom 0.152: 4.16 73.15,23.47 73.15,28.5 71.55,30.1 71.55,42.29 72.39,43.13 IC4.21
N$74
  Top 0.152: 4.15 75.06,22.63 75.06,29.41 76.12,30.48 76.12,39.47 74.98,40.62 IC4.20
N$75
  Bottom 0.152: 4.14 76.5,21.26 76.5,30.25 74.07,32.69 74.07,42.29 74.91,43.13 IC4.19
N$76
  Top 0.152: 4.13 77.72,19.58 77.72,32.08 78.33,32.69 78.33,36.04 76.58,37.8 76.58,39.78 77.42,40.62 IC4.18
N$77
  Top 0.152: 4.10 77.65,13.56 77.65,14.02 74.6,17.07 74.6,21.87 74.22,22.25 74.22,22.94 74.3,23.01 74.3,29.87 74.07,30.1 74.07,37.26 74.91,38.1 IC4.17
N$78
  Bottom 0.152: 4.9 76.58,11.81 76.58,20.12 77.42,20.95 77.42,32.99 IC4.12
N$79  (via drill 0.33)
  Top 0.152: v73,32 73.23,31.77 73.23,24.69 71.17,22.63 71.17,15.7 74.98,11.89 74.98,10.44 4.8
  Bottom 0.152: v73,32 73.38,32 74.91,30.48 IC4.11
N$80
  Bottom 0.152: IC4.10 72.39,31.77 74.3,29.87 74.3,23.01 73.23,21.95 73.23,9.6 4.7
N$81
  Bottom 0.152: IC4.9 73.99,28.88 73.99,23.16 71.17,20.34 71.17,9.3 4.6
N$82
  Bottom 0.152: IC4.8 70.71,32.16 70.71,30.1 70.33,29.72 70.33,23.09 69.11,21.87 69.11,9.6 4.5
N$83
  Bottom 0.152: 4.4 67.28,10.44 67.28,20.5 69.88,23.09 69.88,30.48 IC4.7
N$84
  Bottom 0.152: 4.3 65.68,11.81 65.68,15.62 66.98,16.92 66.98,21.18 68.2,22.4 68.2,32.16 67.36,32.99 IC4.6
N$85
  Bottom 0.152: 4.2 64.62,13.56 64.62,15.01 66.45,16.84 66.45,22.25 66.37,22.33 66.37,29.57 67.28,30.48 IC4.5
N$86
  Bottom 0.152: 4.12 78.33,17.6 78.33,19.05 78.49,19.2 78.49,22.4 78.41,22.48 78.41,36.12 79.86,37.57 79.86,41.22 77.04,44.04 72.01,44.04 68.89,40.92 68.89,37.11 67.36,35.59 IC4.3
N$87
  Top 0.152: L3.4-DIN 48.31,14.94 46.1,14.94 44.35,16.69 34.44,16.69 32.99,18.14 L2.2-DOUT
N$88
  Bottom 0.5: 4.11 78.33,15.47 78.33,14.25 78.72,13.87 78.72,11.43 72.39,5.11 R4.1
N$89
  Top 0.152: L4.4-DIN 68.66,14.94 66.37,14.94 64.62,16.69 54.71,16.69 53.26,18.14 L3.2-DOUT
N$90  (via drill 0.33)
  Top 0.152: v6.25,16.38 7.7,14.94 L1.4-DIN | v4.12,23.62 4.12,32.08 5.18,33.15 5.18,43.2 21.11,59.13 60.27,59.13 61.11,59.97 61.42,59.97 61.95,60.5 61.95,62.48 60.96,63.48 IN.10
  Bottom 0.152: v6.25,16.38 6.25,21.49 v4.12,23.62
N$91  (via drill 0.33)
  Top 0.152: v73.3,44.96 73.61,44.65 73.61,30.1 73.99,29.72 73.99,23.16 73.61,22.78 73.61,18.21 L4.2-DOUT | v74.52,46.18 74.52,52.81 74.68,52.96 74.68,62.48 OUT.10
  Bottom 0.152: v74.52,46.18 v73.3,44.96
N$131
  Bottom 0.152: IC3.27 43.43,44.2 31.55,44.2 30.86,43.51 30.86,41.07 27.05,37.26 26.67,37.26 24.99,35.59 24.16,35.59 IC2.2
N$132
  Top 0.152: IC3.2 44.5,35.59 44.5,36.96 45.34,37.8 45.34,38.56 43.59,40.31 43.59,41 46.63,44.04 63.93,44.04 67.28,40.69 IC4.27
VCC  (via drill 0.33)
  Top 0.5: C1.1 11.05,20.27 11.05,17.45 12.57,15.93 12.57,14.94 L1.1-VDD 12.8,14.71 14.1,14.71 v18.59,10.21 | C2.1 31.39,20.27 31.39,17.45 32.92,15.93 32.92,14.94 L2.1-VDD 32.69,14.78 30.71,12.8 27.58,12.8 24.99,10.21 v24.16,10.21 | C3.1 51.74,20.27 51.66,20.19 51.66,17.53 53.19,16 53.19,14.94 L3.1-VDD 53.19,14.63 53.19,13.95 51.82,12.57 51.82,7.62 | C4.1 72.08,20.27 72.08,17.83 73.53,16.38 73.53,14.94 L4.1-VDD 73.76,14.71 75.06,14.71 77.27,12.5 77.57,12.5 | JP1.2 80.01,14.48 78.03,12.5 77.57,12.5 | 51.82,7.62 51.82,6.4 54.18,4.04 69.88,4.04 75.29,9.45 75.67,9.45 77.57,11.35 77.57,12.5 | 51.82,7.62 v46.33,7.62
  Bottom 0.5: v18.59,10.21 v24.16,10.21 24.38,10.13 26.9,7.62 v46.33,7.62

### Text on the board
tPlace: DL | G | B | 5 | LD | G | C | 5 | D | G